# Altium schematic sheet I2C_Jog_Controller.SchDoc: Bluebell MFG PCB
size C; Author: AM; CompanyName: Cambridge Mobile Telematics; DrawnBy: A.Marles; Engineer: DM; Organization: Silver Bullet Technology; Address1: Schematic; Address2: 101 Main Street, 14th Floor; Address3: Cambridge, MA 02142; Address4: USA; DocumentNumber: 3; SheetNumber: 3; SheetTotal: 6
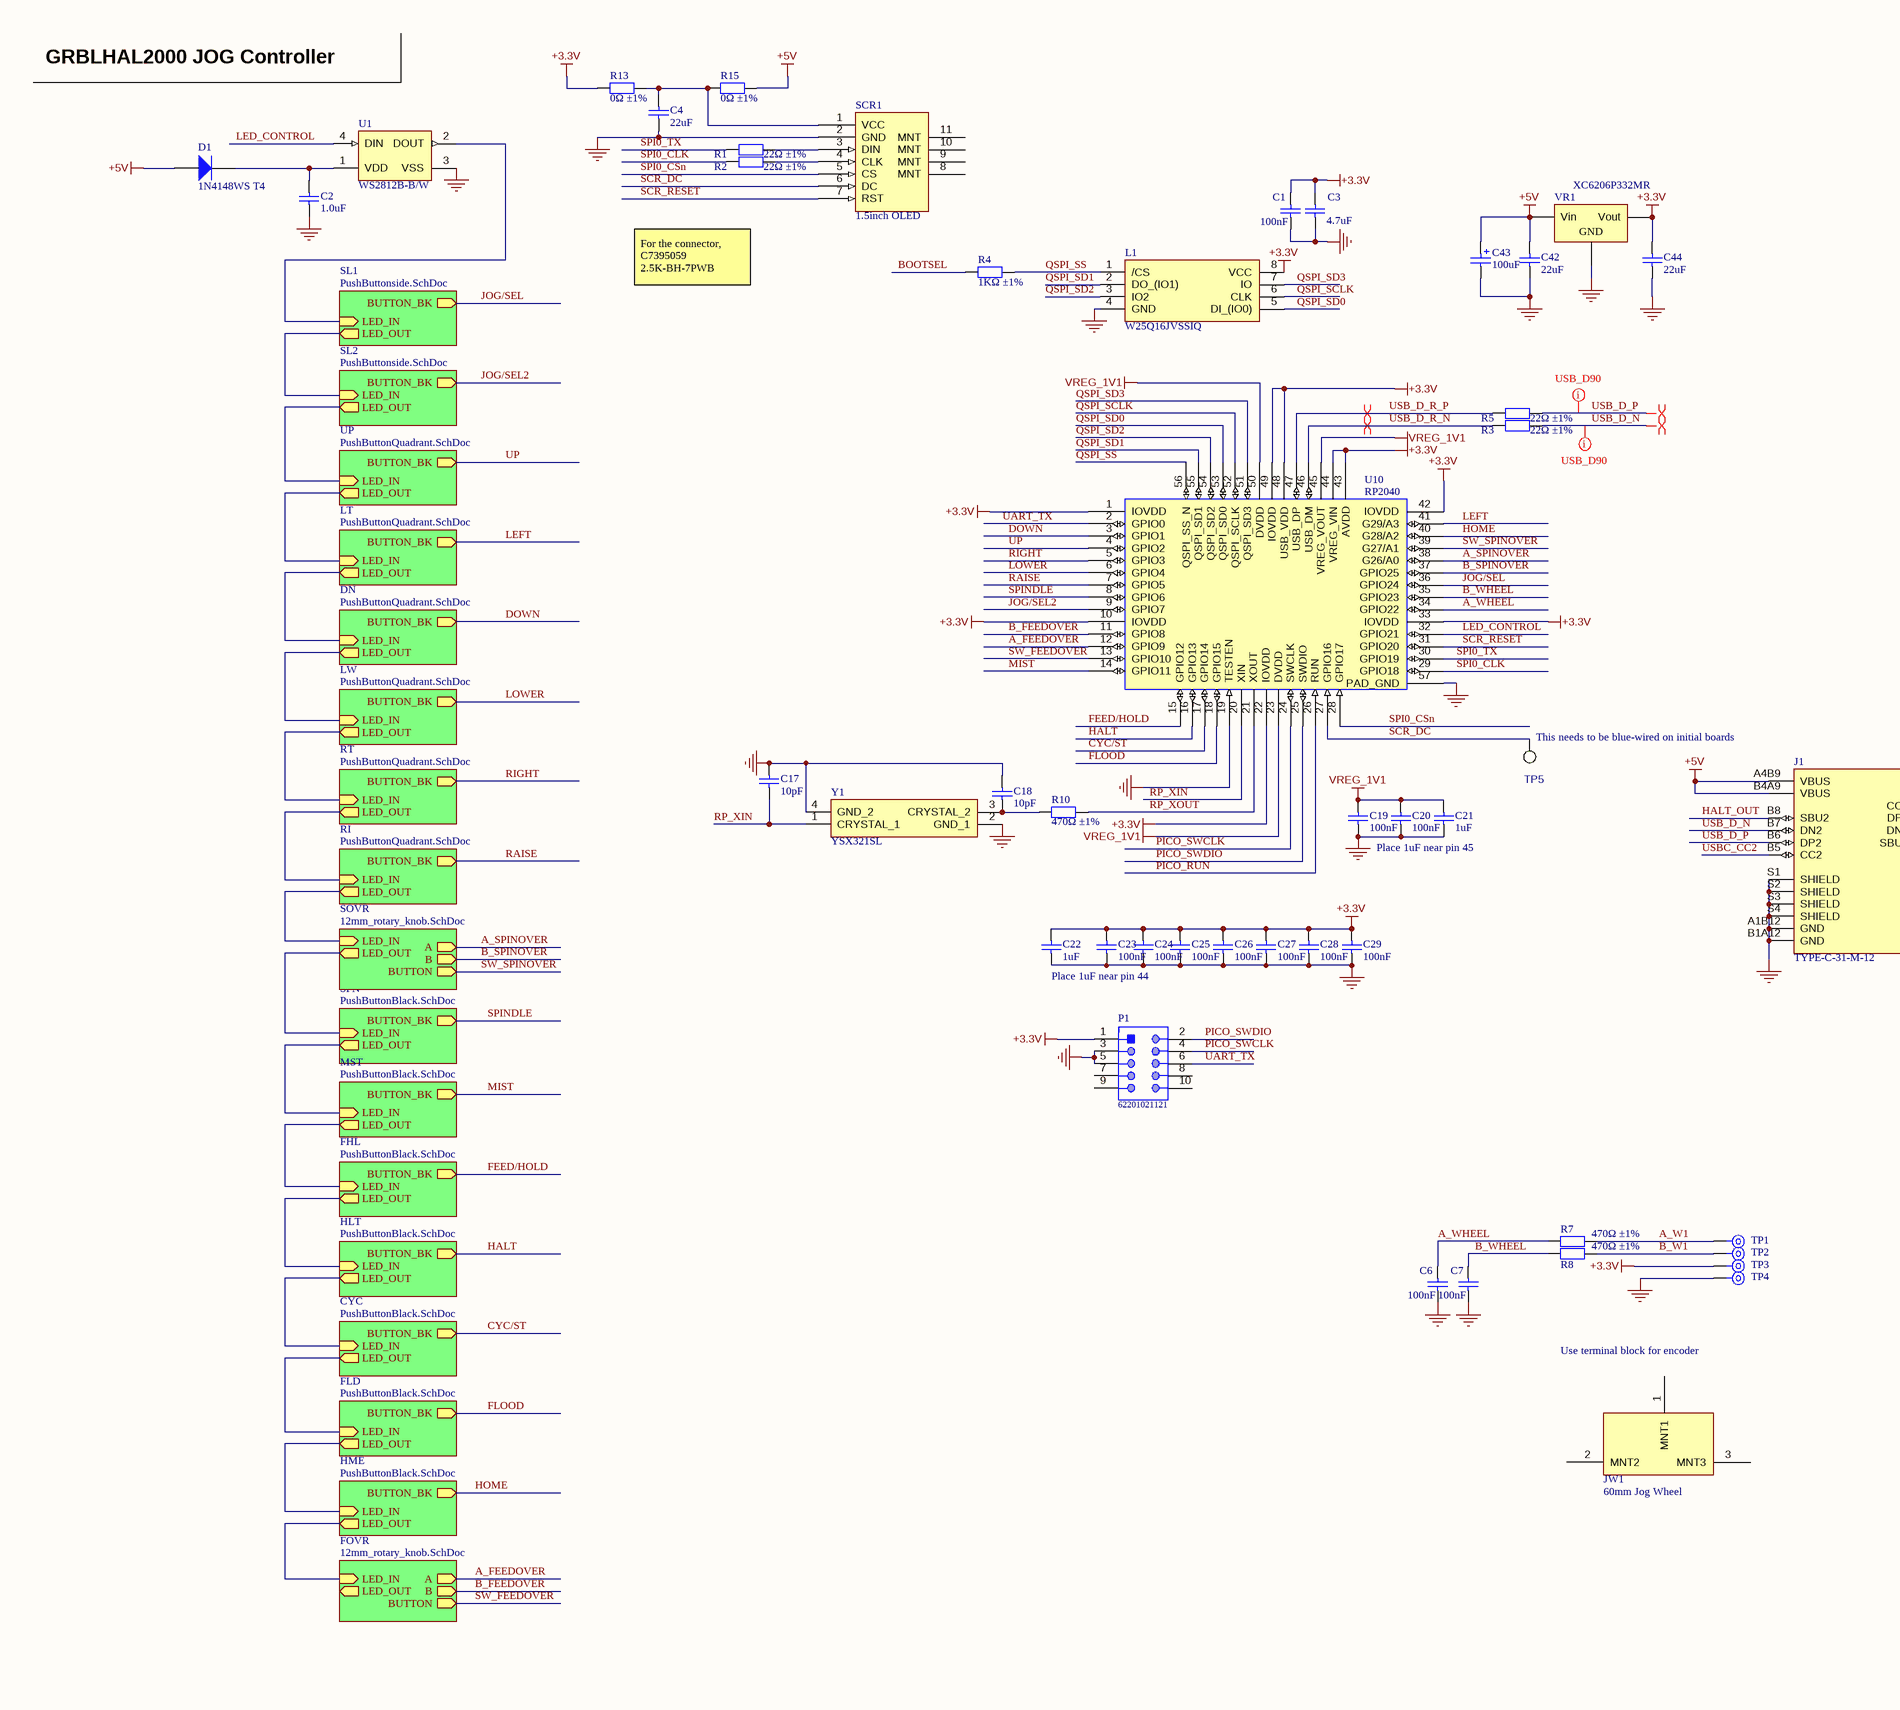
[diagram p0: I2C_Jog_Controller.SchDoc, left]
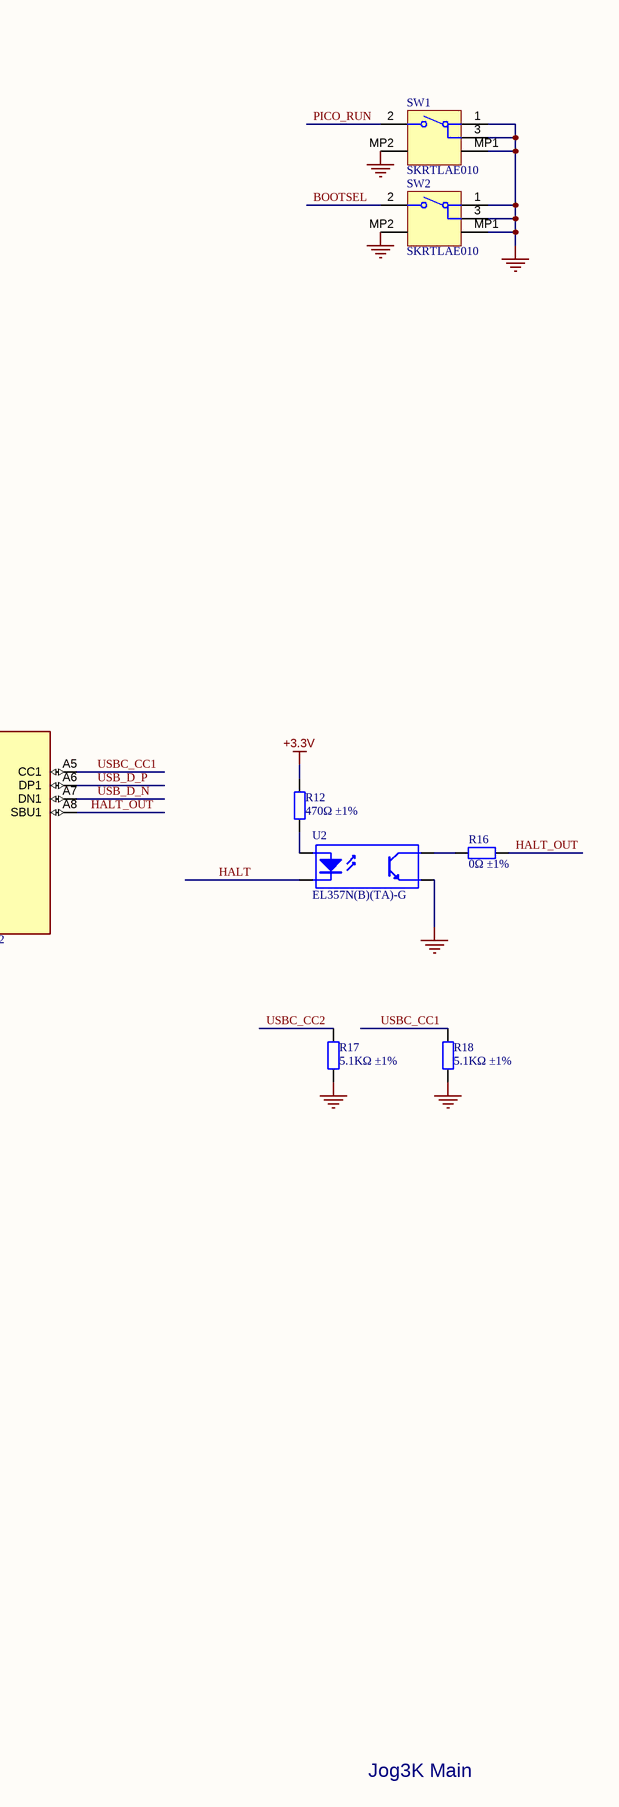
[diagram p1: I2C_Jog_Controller.SchDoc, right]

## Parts
C1  100nF  [0603_C]
C2  1.0uF  [0402_C]
C3  4.7uF  [0603_C]
C4  22uF  [0805_C]
C6  100nF  [0603_C]
C7  100nF  [0603_C]
C17  10pF  [0603_C]
C18  10pF  [0603_C]
C19  100nF  [0603_C]
C20  100nF  [0603_C]
C21  1uF  [0603_C]
C22  1uF  [0603_C]
C23  100nF  [0603_C]
C24  100nF  [0603_C]
C25  100nF  [0603_C]
C26  100nF  [0603_C]
C27  100nF  [0603_C]
C28  100nF  [0603_C]
C29  100nF  [0603_C]
C42  22uF  [0805_C]
C43  100uF  [CASE-B_3528]
C44  22uF  [0805_C]
D1  1N4148WS T4  [SOD-323]
J1  TYPE-C-31-M-12  [HRO_TYPE-C-31-M-12]
JW1  60mm Jog Wheel  [60mm_Jog_wheel]
L1  W25Q16JVSSIQ  [SOIC127P780X195-8N]
P1  62201021121  [62201021121]  (no BOM)
R1  22Ω ±1%  [0603_R]
R2  22Ω ±1%  [0603_R]
R3  22Ω ±1%  [0603_R]
R4  1KΩ ±1%  [0603_R]
R5  22Ω ±1%  [0603_R]
R7  470Ω ±1%  [0603_R]
R8  470Ω ±1%  [0603_R]
R10  470Ω ±1%  [0603_R]
R12  470Ω ±1%  [0603_R]
R13  0Ω ±1%  [0603_R]
R15  0Ω ±1%  [0603_R]  (no BOM)
R16  0Ω ±1%  [0603_R]  (no BOM)
R17  5.1KΩ ±1%  [0603_R]
R18  5.1KΩ ±1%  [0603_R]
SCR1  1.5inch OLED  [1.5inch_Waveshare_OLED]  (no BOM)
SW1  SKRTLAE010  [ALPS-SKRTLAE010_V]
SW2  SKRTLAE010  [ALPS-SKRTLAE010_V]
TP1  2.5mm TP  [TP_SQ_2.5mm]  (value not drawn)  (no BOM)
TP2  2.5mm TP  [TP_SQ_2.5mm]  (value not drawn)  (no BOM)
TP3  2.5mm TP  [TP_SQ_2.5mm]  (value not drawn)  (no BOM)
TP4  2.5mm TP  [TP_SQ_2.5mm]  (value not drawn)  (no BOM)
TP5  TESTPOINT  [TP/SMALL]  (value not drawn)  (no BOM)
U1  WS2812B-B/W  [ADA-RGB-1655_V]
U2  EL357N(B)(TA)-G  [SOP-4_P2.54]
U10  RP2040  [RP2040]
VR1  XC6206P332MR  [SOT-23-3L]
Y1  YSX321SL  [YSX321SL]

## Sub-sheets
CYC = PushButtonBlack.SchDoc: BUTTON_BK (out), LED_IN (in), LED_OUT (out)
DN = PushButtonQuadrant.SchDoc: BUTTON_BK (out), LED_OUT (out), LED_IN (in)
FHL = PushButtonBlack.SchDoc: BUTTON_BK (out), LED_IN (in), LED_OUT (out)
FLD = PushButtonBlack.SchDoc: BUTTON_BK (out), LED_OUT (out), LED_IN (in)
FOVR = 12mm_rotary_knob.SchDoc: LED_OUT (out), LED_IN (in), A (out), B (out), BUTTON (out)
HLT = PushButtonBlack.SchDoc: BUTTON_BK (out), LED_IN (in), LED_OUT (out)
HME = PushButtonBlack.SchDoc: BUTTON_BK (out), LED_IN (in), LED_OUT (out)
LT = PushButtonQuadrant.SchDoc: BUTTON_BK (out), LED_IN (in), LED_OUT (out)
LW = PushButtonQuadrant.SchDoc: BUTTON_BK (out), LED_OUT (out), LED_IN (in)
MST = PushButtonBlack.SchDoc: BUTTON_BK (out), LED_OUT (out), LED_IN (in)
RI = PushButtonQuadrant.SchDoc: BUTTON_BK (out), LED_OUT (out), LED_IN (in)
RT = PushButtonQuadrant.SchDoc: BUTTON_BK (out), LED_IN (in), LED_OUT (out)
SL1 = PushButtonside.SchDoc: BUTTON_BK (out), LED_OUT (out), LED_IN (in)
SL2 = PushButtonside.SchDoc: BUTTON_BK (out), LED_OUT (out), LED_IN (in)
SOVR = 12mm_rotary_knob.SchDoc: LED_OUT (out), LED_IN (in), A (out), B (out), BUTTON (out)
SPN = PushButtonBlack.SchDoc: BUTTON_BK (out), LED_IN (in), LED_OUT (out)
UP = PushButtonQuadrant.SchDoc: BUTTON_BK (out), LED_IN (in), LED_OUT (out)

## Nets
+3.3V: C1.2 C3.2 C22.2 C23.2 C24.2 C25.2 C26.2 C27.2 C28.2 C29.2 C44.2 L1.8(VCC) P1.1 R12.2 R13.2 TP3.1 U10.1(IOVDD) U10.10(IOVDD) U10.22(IOVDD) U10.33(IOVDD) U10.42(IOVDD) U10.43(AVDD) U10.44(VREG_VIN) U10.48(USB_VDD) U10.49(IOVDD) VR1.2(Vout)
+5V: C42.2 C43.1 D1.1(A) J1.A4B9(VBUS) J1.B4A9(VBUS) R15.1 VR1.3(Vin)
GND: C1.1 C2.1 C3.1 C4.1 C6.1 C7.1 C17.2 C18.2 C19.1 C20.1 C21.1 C22.1 C23.1 C24.1 C25.1 C26.1 C27.1 C28.1 C29.1 C42.1 C43.2 C44.1 J1.A1B12(GND) J1.B1A12(GND) J1.S1(SHIELD) J1.S2(SHIELD) J1.S3(SHIELD) J1.S4(SHIELD) L1.4(GND) P1.3 P1.5 R17.2 R18.2 SCR1.2(GND) SW1.1 SW1.3 SW1.MP1 SW1.MP2 SW2.1 SW2.3 SW2.MP1 SW2.MP2 TP4.1 U1.3(VSS) U2.3(E) U10.19(TESTEN) U10.57(PAD_GND) VR1.1(GND) Y1.2(GND_1) Y1.4(GND_2)
VREG_1V1: C19.2 C20.2 C21.2 U10.23(DVDD) U10.45(VREG_VOUT) U10.50(DVDD)
A_FEEDOVER: U10.12(GPIO9) ; sheet FOVR/A
A_SPINOVER: U10.38(G26/A0) ; sheet SOVR/A
A_W1: R7.2 TP1.1
A_WHEEL: C6.2 R7.1 U10.34(GPIO22)
B_FEEDOVER: U10.11(GPIO8) ; sheet FOVR/B
B_SPINOVER: U10.37(GPIO25) ; sheet SOVR/B
B_W1: R8.2 TP2.1
B_WHEEL: C7.2 R8.1 U10.35(GPIO23)
BOOTSEL: R4.1 SW2.2
CYC/ST: U10.17(GPIO14) ; sheet CYC/BUTTON_BK
DOWN: U10.3(GPIO1) ; sheet DN/BUTTON_BK
FEED/HOLD: U10.15(GPIO12) ; sheet FHL/BUTTON_BK
FLOOD: U10.18(GPIO15) ; sheet FLD/BUTTON_BK
HALT: U2.2(K) U10.16(GPIO13) ; sheet HLT/BUTTON_BK
HALT_OUT: J1.A8(SBU1) J1.B8(SBU2) R16.1
HOME: U10.40(G28/A2) ; sheet HME/BUTTON_BK
JOG/SEL: U10.36(GPIO24) ; sheet SL1/BUTTON_BK
JOG/SEL2: U10.9(GPIO7) ; sheet SL2/BUTTON_BK
LED_CONTROL: U1.4(DIN) U10.32(GPIO21)
LEFT: U10.41(G29/A3) ; sheet LT/BUTTON_BK
LOWER: U10.6(GPIO4) ; sheet LW/BUTTON_BK
MIST: U10.14(GPIO11) ; sheet MST/BUTTON_BK
PICO_RUN: SW1.2 U10.26(RUN)
PICO_SWCLK: P1.4 U10.24(SWCLK)
PICO_SWDIO: P1.2 U10.25(SWDIO)
QSPI_SCLK: L1.6(CLK) U10.52(QSPI_SCLK)
QSPI_SD0: L1.5(DI_(IO0)) U10.53(QSPI_SD0)
QSPI_SD1: L1.2(DO_(IO1)) U10.55(QSPI_SD1)
QSPI_SD2: L1.3(IO2) U10.54(QSPI_SD2)
QSPI_SD3: L1.7(IO) U10.51(QSPI_SD3)
QSPI_SS: L1.1(/CS) R4.2 U10.56(QSPI_SS_N)
RAISE: U10.7(GPIO5) ; sheet RI/BUTTON_BK
RIGHT: U10.5(GPIO3) ; sheet RT/BUTTON_BK
RP_XIN: C17.1 U10.20(XIN) Y1.1(CRYSTAL_1)
RP_XOUT: R10.2 U10.21(XOUT)
SCR_DC: SCR1.6(DC) TP5.1 U10.27(GPIO16)
SCR_RESET: SCR1.7(RST) U10.31(GPIO20)
SPI0_CLK: R2.2 U10.29(GPIO18)
SPI0_CSn: SCR1.5(CS) U10.28(GPIO17)
SPI0_TX: R1.2 U10.30(GPIO19)
SPINDLE: U10.8(GPIO6) ; sheet SPN/BUTTON_BK
SW_FEEDOVER: U10.13(GPIO10) ; sheet FOVR/BUTTON
SW_SPINOVER: U10.39(G27/A1) ; sheet SOVR/BUTTON
UART_TX: P1.6 U10.2(GPIO0)
UP: U10.4(GPIO2) ; sheet UP/BUTTON_BK
USB_D_N: J1.A7(DN1) J1.B7(DN2) R3.1
USB_D_P: J1.A6(DP1) J1.B6(DP2) R5.1
USB_D_R_N: R3.2 U10.46(USB_DM)
USB_D_R_P: R5.2 U10.47(USB_DP)
USBC_CC1: J1.A5(CC1) R18.1
USBC_CC2: J1.B5(CC2) R17.1
NetC2_2: C2.2 D1.2(K) U1.1(VDD)
NetC4_2: C4.2 R13.1 R15.2 SCR1.1(VCC)
NetC18_1: C18.1 R10.1 Y1.3(CRYSTAL_2)
NetR1_1: R1.1 SCR1.3(DIN)
NetR2_1: R2.1 SCR1.4(CLK)
NetR12_1: R12.1 U2.1(A)
NetR16_2: R16.2 U2.4(C)
NetU1_2: U1.2(DOUT) ; sheet SL1/LED_IN
(unnamed): sheet SL1/LED_OUT, sheet SL2/LED_IN
(unnamed): sheet LT/LED_IN, sheet UP/LED_OUT
(unnamed): sheet LT/LED_OUT, sheet DN/LED_IN
(unnamed): sheet SL2/LED_OUT, sheet UP/LED_IN
(unnamed): sheet DN/LED_OUT, sheet LW/LED_IN
(unnamed): sheet RT/LED_IN, sheet LW/LED_OUT
(unnamed): sheet RT/LED_OUT, sheet RI/LED_IN
(unnamed): sheet RI/LED_OUT, sheet SOVR/LED_IN
(unnamed): sheet SPN/LED_IN, sheet SOVR/LED_OUT
(unnamed): sheet SPN/LED_OUT, sheet MST/LED_IN
(unnamed): sheet HME/LED_IN, sheet FLD/LED_OUT
(unnamed): sheet HME/LED_OUT, sheet FOVR/LED_IN
(unnamed): sheet FLD/LED_IN, sheet CYC/LED_OUT
(unnamed): sheet MST/LED_OUT, sheet FHL/LED_IN
(unnamed): sheet CYC/LED_IN, sheet HLT/LED_OUT
(unnamed): sheet FHL/LED_OUT, sheet HLT/LED_IN

Not connected (* = marked no-connect by the designer): JW1 1(MNT1) 2(MNT2) 3(MNT3); P1 7 8 9 10; SCR1 8(MNT) 9(MNT) 10(MNT) 11(MNT)

## Layout directives
differential pair: USB_D_N, USB_D_P, USB_D_R_N, USB_D_R_P
net class USB_D90: USB_D_N, USB_D_P

## Notes on the sheet
- GRBLHAL2000 JOG Controller
- For the connector,
  C7395059
  2.5K-BH-7PWB
- (near TP5) This needs to be blue-wired on initial boards
- Place 1uF near pin 45
- Place 1uF near pin 44
- Use terminal block for encoder
- Jog3K Main
- Expatria Technologies
- SHEET
- PROJECT
- REV
- 1136 Glade Court
- Port Coquitlam, BC V3B 1R5
- EMAIL: INFO@EXPATRIA.CA
- SIZE
- ENGR
- C
- MODIFIED
- DOCUMENT
- /
- Copyright Expatria Technologies 2021.  This document describes Open Hardware and is licensed under the CERN-OHL-P  v2.  No warranty is implied or expressed.

## Library data of the parts
C1 C6 C7 C19 C20 C23-C29 = 0603 100nF (104) 10% 50V: Chip capacitors; Manufacturer: YAGEO; PartNumber: CC0603KRX7R9BB104; Tolerance: 10%; Voltage: 50V; ComponentLink1Description: Supplier link; ComponentLink1URL: http://www.szlcsc.com/product/details_15331.html; Package: 0603; Supplier: LC; SuppliersPartNumber: C14663; Capacitance: 100nF
C2 = 0402 1.0uF (105) 10% 25V: Chip capacitor; Manufacturer: Samsung Electro-Mechanics; PartNumber: CL05A105KA5NQNC; Capacitance: 1uF; Tolerance: 10%; Voltage: 25V; ComponentLink1Description: Supplier link; ComponentLink1URL: http://www.szlcsc.com/product/details_53938.html; Package: 0402; Supplier: LC; SuppliersPartNumber: C52923
C3 = 0603 4.7uF (475) 10% 16V: Chip capacitors; Manufacturer: Samsung Electro-Mechanics; PartNumber: CL10A475KO8NNNC; Tolerance: 10%; Voltage: 16V; ComponentLink1Description: Supplier link; ComponentLink1URL: http://www.szlcsc.com/product/details_20375.html; Package: 0603; Supplier: LC; SuppliersPartNumber: C19666; Capacitance: 4.7uF
C4 C42 C44 = 0805 22uF (226) 20% 25V: Chip capacitors; Manufacturer: Samsung Electro-Mechanics; PartNumber: CL21A226MAQNNNE; Tolerance: 20%; Voltage: 25V; ComponentLink1Description: Supplier link; ComponentLink1URL: http://www.szlcsc.com/product/details_46786.html; Package: 0805; Supplier: LC; SuppliersPartNumber: C45783; Capacitance: 22uF
C17 C18 = 0603 10pF (100) 5% 50V: Chip capacitors; Manufacturer: Samsung Electro-Mechanics; PartNumber: CL10C100JB8NNNC; Tolerance: 5%; Voltage: 50V; ComponentLink1Description: Supplier link; ComponentLink1URL: http://www.szlcsc.com/product/details_1986.html; Package: 0603; Supplier: LC; SuppliersPartNumber: C1634; Capacitance: 10pF
C21 C22 = 0603 1uF (105) 10% 50V: Chip capacitors; Manufacturer: Samsung Electro-Mechanics; PartNumber: CL10A105KB8NNNC; Tolerance: 10%; Voltage: 50V; ComponentLink1Description: Supplier link; ComponentLink1URL: http://www.szlcsc.com/product/details_16531.html; Package: 0603; Supplier: LC; SuppliersPartNumber: C15849; Capacitance: 1uF
C43 = 3528 100uF (107) 10% 6.3V: Tantalum capacitor; Manufacturer: AVX; PartNumber: TAJB107K006RNJ; Tolerance: 10%; Voltage: 6.3V; ComponentLink1Description: Supplier link; ComponentLink1URL: http://www.szlcsc.com/product/details_16815.html; Package: 3528; Supplier: LC; SuppliersPartNumber: C16133; Capacitance: 100uF
D1 = SOD-323 1N4148WS T4: 二极管; ComponentLink1Description: 供应商链接; ComponentLink1URL: http://www.szlcsc.com/product/details_2485.html; Package: SOD-323; Supplier: LC; SuppliersPartNumber: C2128
J1 = TYPE-C-31-M-12: USB Connectors 24 Receptacle 1 8.94*7.3mm RoHS; MF: HRO Electronics Co., Ltd.; Value: *; SnapEDA_Link: https://www.snapeda.com/parts/TYPE-C-31-M-12/HRO%20Electronics%20Co.,%20Ltd./view-part/3228496/?ref=snap; Package: Package; MP: TYPE-C-31-M-12; Price: None; Availability: Unavailable; SuppliersPartNumber: C165948
JW1 = 60mm_Jog_Wheel
L1 = W25Q128JVSIQ_TR: SPI NOR FLASH 16Mbit; Manufacturer_Name: Winbond; Datasheet Link: http://www.winbond.com/resource-files/w25q128jv%20spi%20revc%2011162016.pdf; Height: 1.95mm; Manufacturer_Part_Number: W25Q16JVSSIQ; SuppliersPartNumber: C82317
P1 = CMP-1502-00948-1: THT Vertical Pin Header WR-PHD, Pitch 1.27 mm, Dual Row, 10 pins; Manufacturer: Wurth Elektronik; Rated Current: 1A; Pin Number: 10; Working Voltage: 100VAC; Contact Resistance: 20mOhm; Withstanding Voltage: 500VAC; Pitch: 1.27mm; Gender: Male; Mounting Technology: THT; Manufacturer URL: http://www.we-online.de; Package Reference: 62201021121; Row Number: Dual; Datasheet URL: https://katalog.we-online.de/em/datasheet/62201021121.pdf; Publisher: WurthElektronik; Packaging: Box; Operating Temperature: -40to105degC; Orientation: Vertical; Part Number: 62201021121
R1-R3 R5 = 0603 22R (22R0) 1%: Chip resistor; Manufacturer: Uniroyal Elec; PartNumber: 0603WAF220JT5E; Power: 1/10W; ComponentLink1Description: Supplier link; ComponentLink1URL: http://www.szlcsc.com/product/details_24078.html; Package: 0603; Supplier: LC; SuppliersPartNumber: C23345; Resistance: 22Ω; Tolerance: 1%
R4 = 0603 1K (1001) 1%: Chip resistor; Manufacturer: Uniroyal Elec; PartNumber: 0603WAF1001T5E; Power: 1/10W; ComponentLink1Description: Supplier link; ComponentLink1URL: http://www.szlcsc.com/product/details_21904.html; Package: 0603; Supplier: LC; SuppliersPartNumber: C21190; Resistance: 1KΩ; Tolerance: 1%
R7 R8 R10 R12 = 0603 470R (4700) 1%: Chip resistor; Manufacturer: Uniroyal Elec; PartNumber: 0603WAF4700T5E; Power: 1/10W; ComponentLink1Description: Supplier link; ComponentLink1URL: http://www.szlcsc.com/product/details_23906.html; Package: 0603; Supplier: LC; SuppliersPartNumber: C23179; Resistance: 470Ω; Tolerance: 1%
R13 R15 R16 = 0603 0R (0R0) 1%: Chip resistor; Manufacturer: Uniroyal Elec; PartNumber: 0603WAF0000T5E; Power: 1/10W; ComponentLink1Description: Supplier link; ComponentLink1URL: http://www.szlcsc.com/product/details_21903.html; Package: 0603; Supplier: LC; SuppliersPartNumber: C21189; Resistance: 0Ω; Tolerance: 1%
R17 R18 = 0603 5.1K (5101) 1%: Chip resistor; Manufacturer: Uniroyal Elec; PartNumber: 0603WAF5101T5E; Power: 1/10W; ComponentLink1Description: Supplier link; ComponentLink1URL: http://www.szlcsc.com/product/details_23913.html; Package: 0603; Supplier: LC; SuppliersPartNumber: C23186; Resistance: 5.1KΩ; Tolerance: 1%
SCR1 = 1.5inch Waveshare OLED screen: SuppliersPartNumber: C2897370
SW1 SW2 = CMP-2000-07073-2: Side Push Type, 250 V, -40 to 90 degC, 3-Pin SMD, RoHS, Tape and Reel; Manufacturer: ALPS; Operating Force: 1.6N; Folder: Unified Components\Components\New Releases\New\; Maximum Current Rating: 0.05@12VDCA; RevisionId: 1; Pole Throw Configuration: SPST; Switch Configuration: N.O.; AccessRights: 2147483647; Maximum DC Voltage Rating: 12V; ContentType: Unified Component; Rad Hard: No; Mounting: SurfaceMount; Datasheet URL: http://www.alps.com/prod/info/E/PDF/Tact/SurfaceMount/SKRT/SKRT.PDF; Manufacturer URL: http://www.alps.com/e/; ReleaseDate: 22/09/2017 06:13:25 AM; ItemHRID: CMP-2000-07073; ContentTypeGUID: CB3C11C4-E317-11DF-B822-12313F0024A2; LifeCycle: Released; ItemGUID: EAC55BEC-37DC-4BDB-8BA7-D75E6D5C3D75; Packaging: Tape&Reel; Package Reference: SKRTLAE010; FolderGUID: B7F4506A-9127-42E7-A087-46FE7B18D116; Datasheet Version: 06/2015; Mounting Technology: SurfaceMount; LifeCycleStateGUID: 61E382EE-6656-4F12-9E24-BE9327104A25; Package Description: 3-Pin Surface Mount Device, Body 4.5 x 3.55 mm, Pitch 1.225 mm; SuppliersPartNumber: C110293; Manufacturer 1: ALPS
TP1-TP4 = TL_5017: 2.5mm x 3.5mm pad; Manufacturer 1: Keystone Electronics; Manufacturer Part Number 1: 5017; Number of Ports: 1; Value: Test Loop; Supplier 1: Digi-Key; Supplier Part Number 1: 36-5017CT-ND; Stock 1: 203311; Pricing 1: 1 = 0.47000, 10 = 0.44100, 25 = 0.37800, 50 = 0.32140, 100 = 0.30880, 250 = 0.27732, 500 = 0.26472, 1000 = 0.22061, 2500 = 0.20170 (USD); RoHS: Yes; Mount: Surface Mount; Color: White; Contact Plating: Tin; Contact Material: Bronze; Material: Bronze; Package Quantity: 5000; Packaging: Tape and Reel; Termination: Solder; Orientation: Straight; Length: 2.66mm; Depth: 1.01mm; REACH SVHC: No SVHC; Lead Free: Lead Free; ComponentLink1URL: https://datasheet.ciiva.com/18456/5017-18456885.pdf?src-supplier=Digi-Key; ComponentLink1Description: https://datasheet.ciiva.com/18456/5017-18456885.pdf?src-supplier=Digi-Key; ComponentLink2URL: https://datasheet.ciiva.com/18456/5017-18456886.pdf?src-supplier=Digi-Key; ComponentLink2Description: https://datasheet.ciiva.com/18456/5017-18456886.pdf?src-supplier=Digi-Key; ComponentLink3URL: https://datasheet.ciiva.com/18456/5017-18456887.pdf?src-supplier=Digi-Key; ComponentLink3Description: https://datasheet.ciiva.com/18456/5017-18456887.pdf?src-supplier=Digi-Key
TP5 = TESTPOINT: Test Point; Manufacturer 1: N/A; Manufacturer Part Number 1: N/A; Value: Testpoint; Manufacturer: N/A; Manufacturer Part Number: N/A
U1 = CMP-2000-05026-1: Intelligent Control LED Integrated Light Source, 3.5 to 5.3 V, -25 to 80 degC, 4-Pin SMD, RoHS, Tape and Reel; Manufacturer: Worldsemi; Package Description: 4-Pin Surface Mount Device, Body 5 x 5 mm; SuppliersPartNumber: C2874885; Part_Number: WS2812B-B/W
U2 = EL357N(B)(TA)-G_[C6649]: OPTOISOLATOR 3.75KV TRANS 4-SOP; Manufacturer 1: Everlight Elec; ComponentLink1Description: 供应商链接; ComponentLink1URL: http://www.szlcsc.com/product/details_7114.html; Package: SOP-4_P2.54; Supplier: LC; SuppliersPartNumber: C6649; Manufacturer Part Number 1: EL357N(B)(TA)-G
U10 = RP2040: RP2040 First MCU from RPI
VR1 = SOT-23 XC6206P332MR: 200mA 680mV@(100mA) Fixed 3.3V~3.3V Positive 1 6V SOT-23-3L Linear Voltage Regulators (LDO) ROHS; ComponentLink1Description: 供应商链接; ComponentLink1URL: http://www.szlcsc.com/product/details_5896.html; Package: SOT-23; Supplier: LC; SuppliersPartNumber: C5446
Y1 = YSX321SL: Crystal or Oscillator; Manufacturer_Name: YXC; Datasheet Link: https://datasheet.lcsc.com/szlcsc/YSX321SL-30MHZ-10PF-8PPM_C70576.pdf; Height: 0.8mm; Manufacturer_Part_Number: YSX321SL; SuppliersPartNumber: C9002